# Altium schematic sheet PiPicoInterface.SchDoc
size 297 x 209 mm; CompanyName: Sainsbury Wellcome Centre; Organization: Innovation and Research FabLab; Address1: Sainsbury Wellcome Centre; Address2: 25 Howland Street; Address3: London; Address4: W1T 4JG; DocumentNumber: PIEUddmmyy; SheetNumber: 1; SheetTotal: 4; swcgroup: FabLabs; Org: Sainsbury Wellcome Centre; Add1: 25 Howland Street; Add2: London; Add3: W1T 4JG; WebAddress: www.sainsburywellcome.org; SheetSize: A4; SheetName: Pi Pico Interface
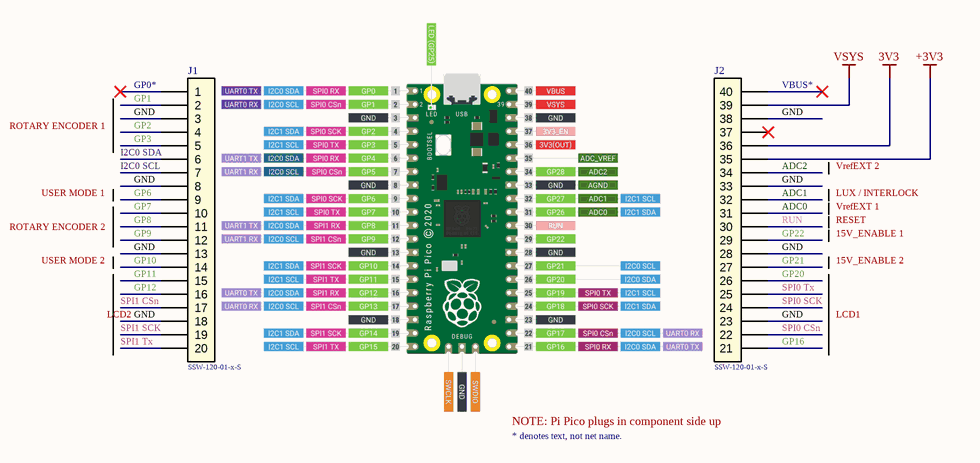
[diagram p0: PiPicoInterface.SchDoc]

## Parts
J1  SSW-120-01-x-S  [SAMTEC_SSW-120-01-G-S]
J2  SSW-120-01-x-S - 21-40  [SAMTEC_SSW-120-01-G-S - 21-40]  (value not drawn)

## Nets
3V3: J2.36
+3V3: J2.35
VSYS: J2.39
ADC0: J2.31
ADC1: J2.32
ADC2: J2.34
GND: J1.3 J1.8 J1.13 J1.18 J2.23 J2.28 J2.33 J2.38
GP1: J1.2
GP2: J1.4
GP3: J1.5
GP6: J1.9
GP7: J1.10
GP8: J1.11
GP9: J1.12
GP10: J1.14
GP11: J1.15
GP12: J1.16
GP16: J2.21
GP20: J2.26
GP21: J2.27
GP22: J2.29
I2C0 SCL: J1.7
I2C0 SDA: J1.6
RUN: J2.30
SPI0 CSn: J2.22
SPI0 SCK: J2.24
SPI0 Tx: J2.25
SPI1 CSn: J1.17
SPI1 SCK: J1.19
SPI1 Tx: J1.20

Not connected (* = marked no-connect by the designer): J1 1*; J2 37* 40*

## Notes on the sheet
- (near J1) GP0*
- (near J2) VBUS*
- ROTARY ENCODER 1
- VrefEXT 2
- ROTARY ENCODER 2
- USER MODE 1
- VrefEXT 1
- LUX / INTERLOCK
- 15V_ENABLE 1
- RESET
- USER MODE 2
- LCD2
- 15V_ENABLE 2
- LCD1
- (near J2) SSW-120-01-x-S
- NOTE: Pi Pico plugs in component side up
- * denotes text, not net name.
- FILE
- VARIANT
- DATE
- REVISION
- SHEET
- /
- PROJECT
- SIZE

## Library data of the parts
J1 = CMP-310-0034-3: Conn Socket Strip SKT 20 POS 2.54mm Solder ST Thru-Hole; Gender: Female; Number of Contacts: 20; Mating Cycles: 100; Number of Rows: 1; Color: Black; RoHS Compliant: Yes; Contact Plating: Gold; Pitch: 2.54mm; Termination: Solder; Contact Material: Bronze; Mount: Through Hole
J2 = CMP-310-0035-2: Conn Socket Strip SKT 20 POS 2.54mm Solder ST Thru-Hole (pins 21 - 40); Gender: Female; Mating Cycles: 100; Number of Contacts: 20; Contact Material: Bronze; RoHS Compliant: Yes; Number of Rows: 1; Contact Plating: Gold; Mount: Through Hole; Pitch: 2.54mm; Termination: Solder; Color: Black